# Altium schematic sheet Radio.SchDoc
size A
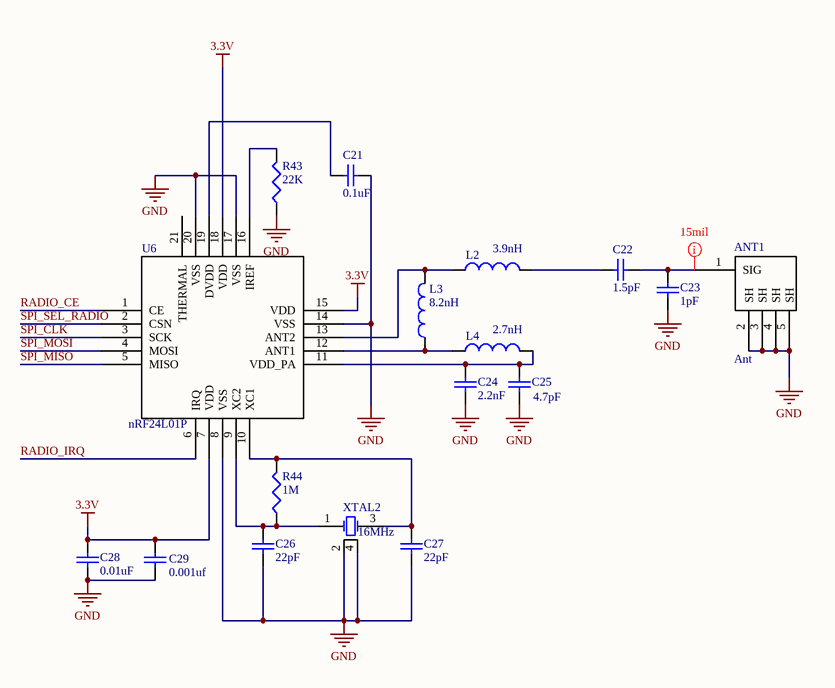
[diagram p0: Radio.SchDoc]

## Parts
ANT1  Ant  [AntennaSMA]
C21  value 0.1uF  [CAPC1005L]  (hidden comment: Cap Semi)
C22  value 1.5pF  [CAPC1005L]  (hidden comment: Cap Semi)
C23  value 1pF  [CAPC1005L]  (hidden comment: Cap Semi)
C24  value 2.2nF  [CAPC1005L]  (hidden comment: Cap Semi)
C25  value 4.7pF  [CAPC1005L]  (hidden comment: Cap Semi)
C26  value 22pF  [CAPC1005L]  (hidden comment: Cap Semi)
C27  value 22pF  [CAPC1005L]  (hidden comment: Cap Semi)
C28  value 0.01uF  [CAPC1005L]  (hidden comment: Cap Semi)
C29  value 0.001uf  [CAPC1005L]  (hidden comment: Cap Semi)
L2  value 3.9nH  [INDC1005AL]  (hidden comment: Inductor)
L3  value 8.2nH  [INDC1005AL]  (hidden comment: Inductor)
L4  value 2.7nH  [INDC1005AL]  (hidden comment: Inductor)
R43  value 22K  [RESC1608L]  (hidden comment: Res3)
R44  value 1M  [RESC1608L]  (hidden comment: Res3)
U6  nRF24L01P  [QFN-20]
XTAL2  16MHz  [CRYSTAL]

## Nets
3.3V: C28.2 C29.2 U6.7(VDD) U6.15(VDD) U6.18(VDD)
GND: ANT1.2(SH) ANT1.3(SH) ANT1.4(SH) ANT1.5(SH) C21.1 C23.1 C24.1 C25.1 C26.1 C27.1 C28.1 C29.1 R43.1 U6.8(VSS) U6.14(VSS) U6.17(VSS) U6.20(VSS) XTAL2.2(GND) XTAL2.4(GND)
RADIO_CE: U6.1(CE)
RADIO_IRQ: U6.6(IRQ)
SPI_CLK: U6.3(SCK)
SPI_MISO: U6.5(MISO)
SPI_MOSI: U6.4(MOSI)
SPI_SEL_RADIO: U6.2(CSN)
NetANT1_1: ANT1.1(SIG) C22.1 C23.2
NetC21_2: C21.2 U6.19(DVDD)
NetC22_2: C22.2 L2.2
NetC24_2: C24.2 C25.2 L4.2 U6.11(VDD_PA)
NetC26_2: C26.2 R44.1 U6.9(XC2) XTAL2.1(OSC1)
NetC27_2: C27.2 R44.2 U6.10(XC1) XTAL2.3(OSC2)
NetL2_1: L2.1 L3.2 U6.13(ANT2)
NetL3_1: L3.1 L4.1 U6.12(ANT1)
NetR43_2: R43.2 U6.16(IREF)

Not connected (* = marked no-connect by the designer): U6 21(THERMAL)

## Layout directives
rule Width Constraint [Pref Width = 15mil    Min Width = 8mil    Max Width = 20mil]: NetANT1_1

## Library data of the parts
ANT1 = AntennaConn
C21-C29 = Cap Semi: Capacitor (Semiconductor SIM Model); Published: 8-Jun-2000; LatestRevisionDate: 29-May-2009; LatestRevisionNote: IPC-7351 Footprint Added.; PackageReference: C1206; Publisher: Altium Limited; PackageDescription: Chip Capacitor
L2-L4 = Inductor: Code_IEC: 1005; Published: 8-Jun-2000; LatestRevisionDate: 29-May-2009; LatestRevisionNote: IPC-7351 Footprint Added.; PackageReference: 0402-A; Publisher: Altium Limited; PackageDescription: Chip Inductor; Code_JEITA: 0402
R43 R44 = Res3: Resistor; Published: 8-Jun-2000; LatestRevisionDate: 29-May-2009; LatestRevisionNote: IPC-7351 Footprint Added.; PackageReference: J1-0603; Publisher: Altium Limited; PackageDescription: Chip Resistor
U6 = radio-nRF24L01P
XTAL2 = Crystal